# EAGLE design Sens_SI7005 (EAGLE 6.3)
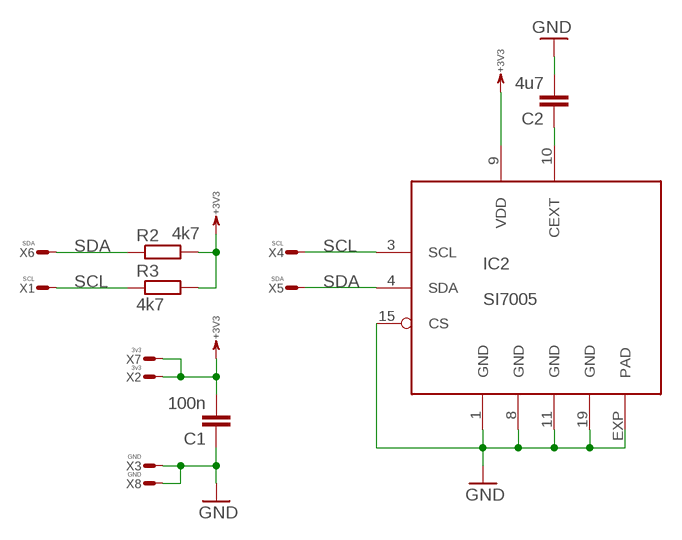
[diagram p0: schematic, sheet 1]

## Parts
C1  100n  C0603  [0603]
C2  4u7  C0603  [0603]
IC2  SI7005  [QFN24]
R2  4k7  R0603  [0603]
R3  4k7  R0603  [0603]
X1  SCL  WIREPADT1.6/0.9  [T1.6/0.9]
X2  3v3  WIREPADT1.6/0.9  [T1.6/0.9]
X3  GND  WIREPADT1.6/0.9  [T1.6/0.9]
X4  SCL  WIREPADT1.6/0.9  [T1.6/0.9]
X5  SDA  WIREPADT1.6/0.9  [T1.6/0.9]
X6  SDA  WIREPADT1.6/0.9  [T1.6/0.9]
X7  3v3  WIREPADT1.6/0.9  [T1.6/0.9]
X8  GND  WIREPADT1.6/0.9  [T1.6/0.9]

## Nets
+3V3: C1.2 IC2.9(VDD) R2.2 R3.2 X2.1(S) X7.1(S)
GND: C1.1 C2.2 IC2.1(GND) IC2.8(GND) IC2.11(GND) IC2.15(CS) IC2.19(GND) IC2.EXP(PAD) X3.1(S) X8.1(S)
N$1: C2.1 IC2.10(CEXT)
SCL: IC2.3(SCL) R3.1 X1.1(S) X4.1(S)
SDA: IC2.4(SDA) R2.1 X5.1(S) X6.1(S)

## Library data of the parts
C1 C2 = RCL:C: Capacitor SMD
IC2 = Sensors:SI7005
R2 R3 = RCL:R: Resistor SMD
X1-X8 = Conn:WIREPAD: Wire PAD connect wire on PCB

## Board
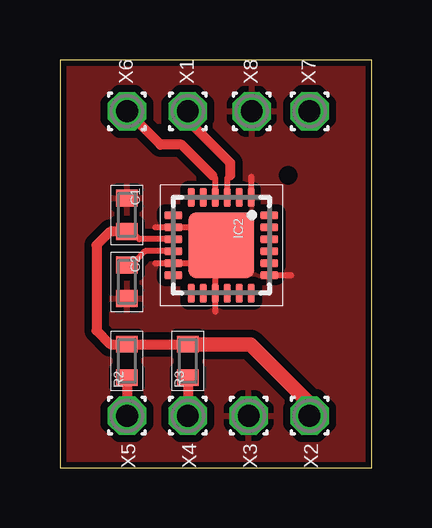
[diagram p1: board, top side]
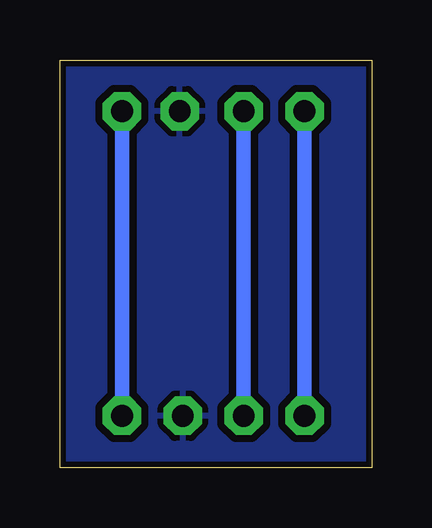
[diagram p2: board, bottom side, seen from below]

Size 13 x 17 mm. Coordinates in mm from the lower left corner, seen from the top.
Outline: 0,0 13,0 13,17 0,17 0,0
Copper layers (1*16): Top 0.035mm / dielectric 1.5mm / Bottom 0.035mm
Design rules "default *": minimum track width 10mil, minimum drill 12mil, track to track 12mil, track to pad 12mil, pad to pad 12mil, via to via 12mil, smd to smd 12mil, copper to edge 10mil, drill to drill 8mil, minimum pad ring 10mil, minimum via ring 8mil, stop-mask expansion 4mil, vias tented up to drill 0mil, thermal gap 10mil
tRestrict: area 9.1,11.8 to 9.9,12.6

### Footprints (pad centres in the part's own frame; a part is rotated, then mirrored left to right if it is on the bottom)
0603 = smd 0.7 x 0.9: 1 -0.697,0; 2 0.697,0
QFN24 = smd 0.75 x 0.3: 1 -2,1.25; 2 -2,0.75; 3 -2,0.25; 4 -2,-0.25; 5 -2,-0.75; 6 -2,-1.25; 13 2,-1.25; 14 2,-0.75; 15 2,-0.25; 16 2,0.25; 17 2,0.75; 18 2,1.25 | smd 0.3 x 0.75: 7 -1.25,-2; 8 -0.75,-2; 9 -0.25,-2; 10 0.25,-2; 11 0.75,-2; 12 1.25,-2; 19 1.25,2; 20 0.75,2; 21 0.25,2; 22 -0.25,2; 23 -0.75,2; 24 -1.25,2 | smd 2.75 x 2.75: EXP 0,0
T1.6/0.9 = drill 0.914 pad 1.6 octagon: 1 0,0

### Placement (x,y rotation side)
C1  2.79,10.54 270 top
C2  2.79,7.75 270 top
IC2  6.73,9.27 270 top
R2  2.79,4.45 90 top
R3  5.33,4.45 90 top
X1  5.33,14.86 90 top
X2  10.41,2.16 270 top
X3  7.87,2.16 270 top
X4  5.33,2.16 270 top
X5  2.79,2.16 270 top
X6  2.79,14.86 90 top
X7  10.41,14.86 90 top
X8  8,14.86 90 top

### Tracks (layer width: path | path; a pad name or v marks a point on that pad's centre or on a via)
+3V3
  Top 0.254: IC2.9 3.31,9.52 3.05,9.78 2.86,9.78 C1.2
  Top 0.406: C1.2 2.1,9.84 1.52,9.27 1.52,5.71 2.1,5.14 R2.2 R3.2
  Top 0.61: R3.2 7.94,5.14 10.41,2.67 X2.1
  Bottom 0.61: X7.1 X2.1
GND
  Top 0.254: 6.48,8.26 IC2.15 6.48,6.51 | 6.48,8.26 6.41,8.9 IC2.EXP | 6.48,8.26 6.39,8.52 IC2.11 3.97,8.52 | 6.39,10.02 IC2.8 3.97,10.02 | 7.98,11.15 7.98,12.13 | 8.61,8.02 9.64,8.02
  Top 0.406: 6.39,10.02 6.39,9.61 IC2.EXP
  pour Top: 0,17 13,17 13,0 0,0
  pour Bottom: 0,0 13,0 13,17 0,17
N$1
  Top 0.254: IC2.10 3.56,9.02 3.17,8.64 2.99,8.64 C2.1
SCL
  Top 0.254: IC2.3 6.98,12.06 7.11,12.19
  Top 0.406: R3.1 X4.1 | 7.11,12.19 7.11,12.7 5.33,14.48 X1.1
  Bottom 0.61: X4.1 X1.1
SDA
  Top 0.254: IC2.4 6.48,12.06 6.35,12.19
  Top 0.406: R2.1 X5.1 | 6.35,12.19 5.08,13.46 4.19,13.46 X6.1
  Bottom 0.61: X5.1 X6.1